# EAGLE design TMotor_Rev0_5 (EAGLE 9.6.2)

## Sheet 1 of 5: Arduino Nano Sense and Teensy
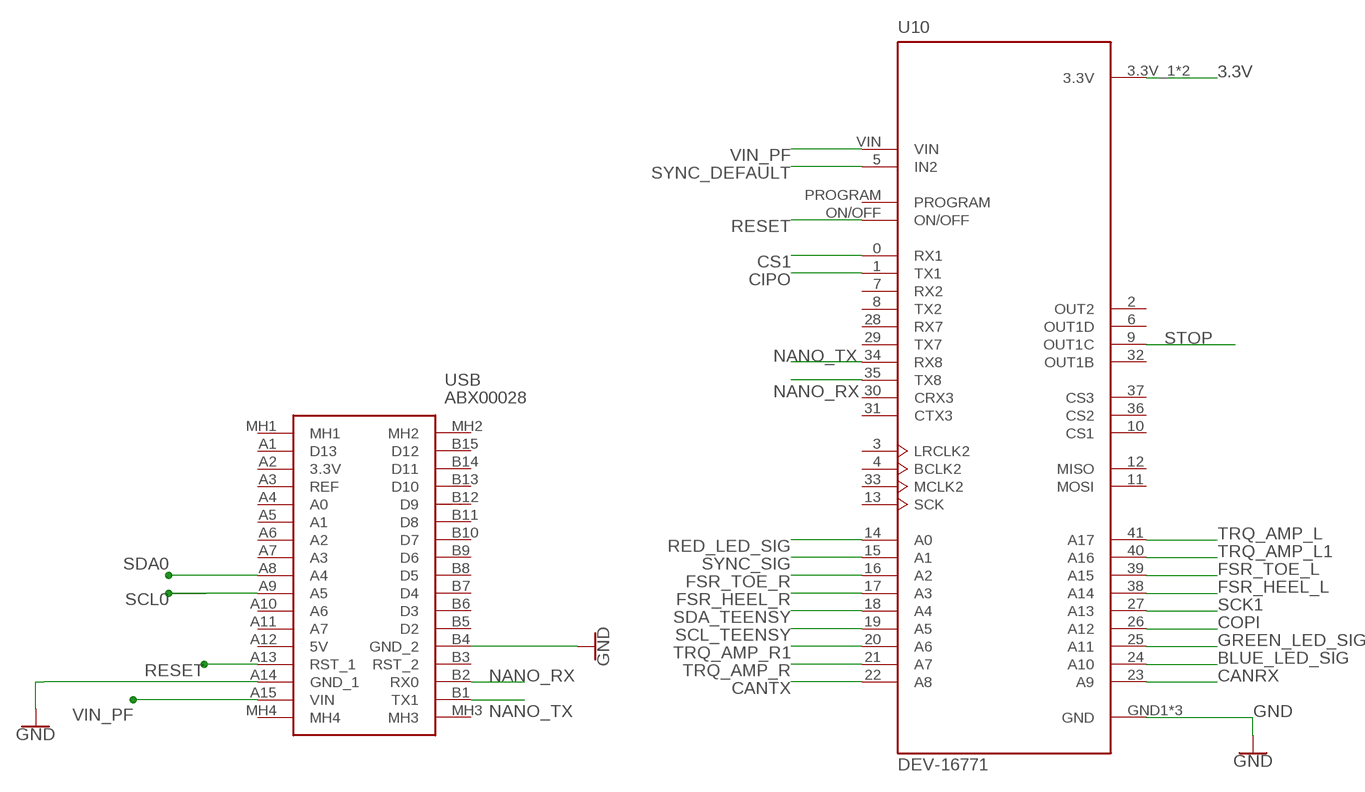
[diagram p0: schematic, sheet 1]

### Parts
U10  DEV-16771  [MODULE_DEV-16771]
USB  ABX00028  [ABX00028]

### Nets
3.3V: U10.3.3V_1(3.3V) U10.3.3V_2(3.3V) ; also sheet 2,3,4,5
BLUE_LED_SIG: U10.24(A10) ; also sheet 4
CANRX: U10.23(A9) ; also sheet 2
CANTX: U10.22(A8) ; also sheet 2
CIPO: U10.1(TX1) ; also sheet 2
COPI: U10.26(A12) ; also sheet 2
CS1: U10.0(RX1) ; also sheet 2
FSR_HEEL_L: U10.38(A14) ; also sheet 3
FSR_HEEL_R: U10.17(A3) ; also sheet 3
FSR_TOE_L: U10.39(A15) ; also sheet 3
FSR_TOE_R: U10.16(A2) ; also sheet 3
GND: U10.GND1(GND) U10.GND2(GND) U10.GND3(GND) USB.A14(GND_1) USB.B4(GND_2) ; also sheet 2,3,4,5
GREEN_LED_SIG: U10.25(A11) ; also sheet 4
NANO_RX: U10.35(TX8) USB.B2(RX0)
NANO_TX: U10.34(RX8) USB.B1(TX1)
RED_LED_SIG: U10.14(A0) ; also sheet 4
RESET: U10.ON/OFF USB.A13(RST_1) ; also sheet 2
SCK1: U10.27(A13) ; also sheet 2
SCL0: USB.A9(A5) ; also sheet 2
SCL_TEENSY: U10.19(A5) ; also sheet 2
SDA0: USB.A8(A4) ; also sheet 2
SDA_TEENSY: U10.18(A4) ; also sheet 2
STOP: U10.9(OUT1C) ; also sheet 2
SYNC_DEFAULT: U10.5(IN2) ; also sheet 2
SYNC_SIG: U10.15(A1) ; also sheet 4
TRQ_AMP_L: U10.41(A17) ; also sheet 5
TRQ_AMP_L1: U10.40(A16) ; also sheet 5
TRQ_AMP_R: U10.21(A7) ; also sheet 5
TRQ_AMP_R1: U10.20(A6) ; also sheet 5
VIN_PF: U10.VIN USB.A15(VIN) ; also sheet 2
Unconnected: U10.2(OUT2) U10.3(LRCLK2) U10.4(BCLK2) U10.6(OUT1D) U10.7(RX2) U10.8(TX2) U10.10(CS1) U10.11(MOSI) U10.12(MISO) U10.13(SCK) U10.28(RX7) U10.29(TX7) U10.30(CRX3) U10.31(CTX3) U10.32(OUT1B) U10.33(MCLK2) U10.36(CS2) U10.37(CS3) U10.PROGRAM USB.A1(D13) USB.A2(3.3V) USB.A3(REF) USB.A4(A0) USB.A5(A1) USB.A6(A2) USB.A7(A3) USB.A10(A6) USB.A11(A7) USB.A12(5V) USB.B3(RST_2) USB.B5(D2) USB.B6(D3) USB.B7(D4) USB.B8(D5) USB.B9(D6) USB.B10(D7) USB.B11(D8) USB.B12(D9) USB.B13(D10) USB.B14(D11) USB.B15(D12) USB.MH1 USB.MH2 USB.MH3 USB.MH4

## Sheet 2 of 5: Motor Drivers & Power
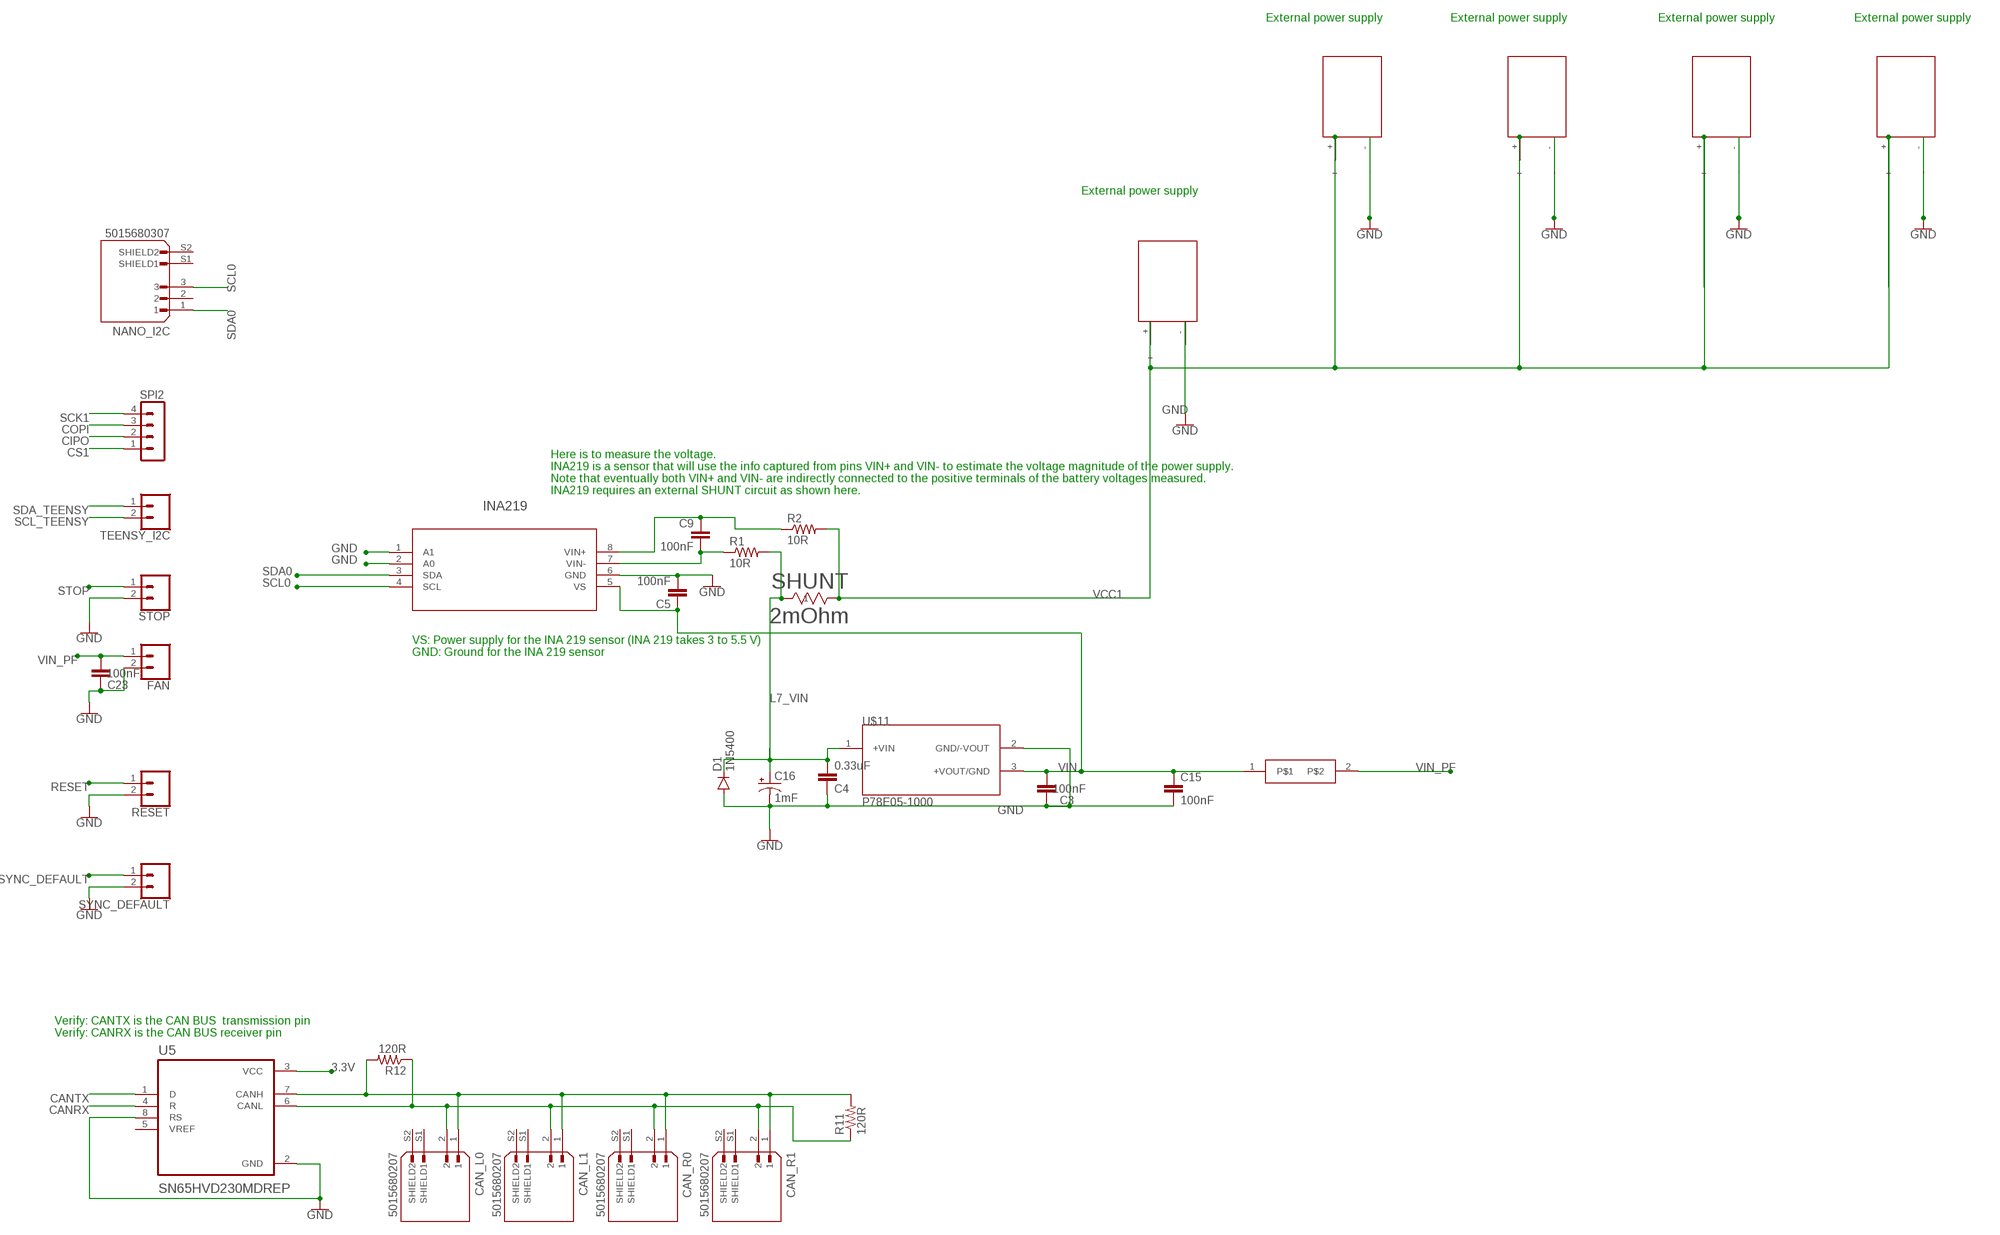
[diagram p1: schematic, sheet 2]

### Parts
C3  100nF  C-EU050-024X044  [C050-024X044]
C4  0.33uF  C-EU050-024X044  [C050-024X044]
C5  100nF  C-EU050-024X044  [C050-024X044]
C9  100nF  C-EU050-024X044  [C050-024X044]
C15  100nF  C-EU050-024X044  [C050-024X044]
C16  1mF  CPOL-USE5-10.5  [E5-10,5]
C23  100nF  C-EU050-024X044  [C050-024X044]
CAN_L0  5015680207  [MOLEX_5015680207]
CAN_L1  5015680207  [MOLEX_5015680207]
CAN_R0  5015680207  [MOLEX_5015680207]
CAN_R1  5015680207  [MOLEX_5015680207]
D1  1N5400  [DO201-15]
FAN  CONN_02  [1X02]
INA219  INA219AIDR  [D8_TEX]
NANO_I2C  5015680307  [MOLEX_5015680307]
R1  10R  R-US_0207/10  [0207/10]
R2  10R  R-US_0207/10  [0207/10]
R11  120R  R-US_0207/10  [0207/10]
R12  120R  R-US_0207/10  [0207/10]
RESET  CONN_02  [1X02]
SHUNT  2mOhm  CSNL2512FT2L00  [STA_CSNL2512(2)_STP]
SPI2  MA04-1  [MA04-1]
STOP  CONN_02  [1X02]
SYNC_DEFAULT  CONN_02  [1X02]
TEENSY_I2C  CONN_02  [1X02]
U5  SN65HVD230MDREP  [SOIC127P599X175-8N]
U$6  0458002.DR  [FUSE_LITTEL_448]
U$11  P78E05-1000  [P78E05-1000]
XT30UPB-F  L_0  XT30UPB-F  [XT30UPB-F]
XT30UPB-F1  L_0  XT30UPB-F  [XT30UPB-F]
XT30UPB-F2  L_0  XT30UPB-F  [XT30UPB-F]
XT30UPB-F3  L_0  XT30UPB-F  [XT30UPB-F]
XT30UPB-F4  L_0  XT30UPB-F  [XT30UPB-F]

### Nets
3.3V: U5.3(VCC) ; also sheet 1,3,4,5
CANRX: U5.4(R) ; also sheet 1
CANTX: U5.1(D) ; also sheet 1
CIPO: SPI2.2 ; also sheet 1
COPI: SPI2.3 ; also sheet 1
CS1: SPI2.1 ; also sheet 1
GND: C3.1 C4.1 C5.2 C15.2 C16.- C23.1 D1.A FAN.2 INA219.1(A1) INA219.2(A0) INA219.6(GND) RESET.2 STOP.2 SYNC_DEFAULT.2 U5.2(GND) U5.8(RS) U$11.2(GND/-VOUT) XT30UPB-F1.- XT30UPB-F2.- XT30UPB-F3.- XT30UPB-F4.- XT30UPB-F.- ; also sheet 1,3,4,5
L7_VIN: C4.2 C16.+ D1.C R1.2 SHUNT.1 U$11.1(+VIN)
N$23: C9.1 INA219.8(VIN+) R2.1
N$26: C9.2 INA219.7(VIN-) R1.1
N$44: CAN_L0.1 CAN_L1.1 CAN_R0.1 CAN_R1.1 R11.2 R12.2 U5.7(CANH)
N$45: CAN_L0.2 CAN_L1.2 CAN_R0.2 CAN_R1.2 R11.1 R12.1 U5.6(CANL)
RESET: RESET.1 ; also sheet 1
SCK1: SPI2.4 ; also sheet 1
SCL0: INA219.4(SCL) NANO_I2C.3 ; also sheet 1
SCL_TEENSY: TEENSY_I2C.2 ; also sheet 1
SDA0: INA219.3(SDA) NANO_I2C.1 ; also sheet 1
SDA_TEENSY: TEENSY_I2C.1 ; also sheet 1
STOP: STOP.1 ; also sheet 1
SYNC_DEFAULT: SYNC_DEFAULT.1 ; also sheet 1
VCC1: R2.2 SHUNT.2 XT30UPB-F1.+ XT30UPB-F2.+ XT30UPB-F3.+ XT30UPB-F4.+ XT30UPB-F.+
VIN: C3.2 C5.1 C15.1 INA219.5(VS) U$6.1 U$11.3(+VOUT/GND)
VIN_PF: C23.2 FAN.1 U$6.2 ; also sheet 1
Unconnected: CAN_L0.S1(SHIELD1) CAN_L0.S2(SHIELD2) CAN_L1.S1(SHIELD1) CAN_L1.S2(SHIELD2) CAN_R0.S1(SHIELD1) CAN_R0.S2(SHIELD2) CAN_R1.S1(SHIELD1) CAN_R1.S2(SHIELD2) NANO_I2C.2 NANO_I2C.S1(SHIELD1) NANO_I2C.S2(SHIELD2) U5.5(VREF)

### Notes on the sheet
- External power supply | External power supply | External power supply | External power supply
- External power supply
- Here is to measure the voltage.
  INA219 is a sensor that will use the info captured from pins VIN+ and VIN- to estimate the voltage magnitude of the power supply.
  Note that eventually both VIN+ and VIN- are indirectly connected to the positive terminals of the battery voltages measured.
  INA219 requires an external SHUNT circuit as shown here.
- VS: Power supply for the INA 219 sensor (INA 219 takes 3 to 5.5 V)
  GND: Ground for the INA 219 sensor
- Verify: CANTX is the CAN BUS  transmission pin
  Verify: CANRX is the CAN BUS receiver pin

## Sheet 3 of 5: FSRs filters
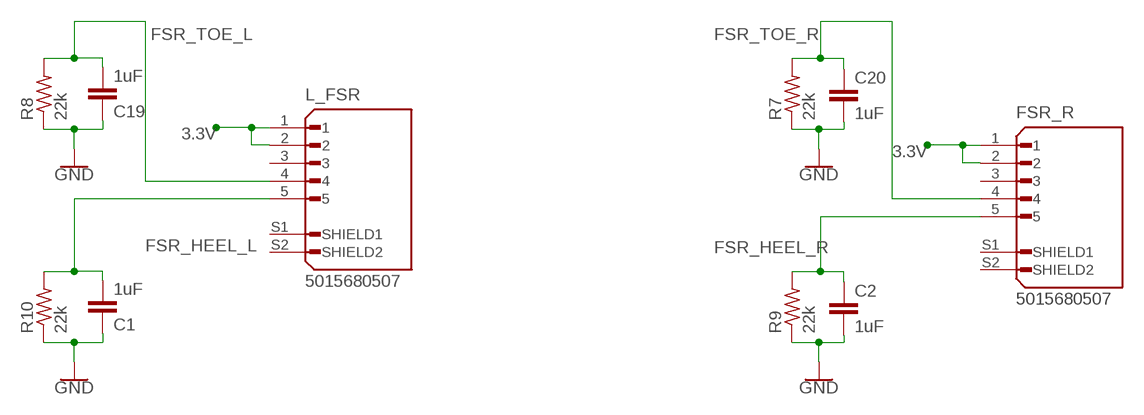
[diagram p2: schematic, sheet 3]

### Parts
C1  1uF  C-EU050-024X044  [C050-024X044]
C2  1uF  C-EU050-024X044  [C050-024X044]
C19  1uF  C-EU050-024X044  [C050-024X044]
C20  1uF  C-EU050-024X044  [C050-024X044]
FSR_R  5015680507  [MOLEX_5015680507]
L_FSR  5015680507  [MOLEX_5015680507]
R7  22k  R-US_0207/10  [0207/10]
R8  22k  R-US_0207/10  [0207/10]
R9  22k  R-US_0207/10  [0207/10]
R10  22k  R-US_0207/10  [0207/10]

### Nets
3.3V: FSR_R.1 FSR_R.2 L_FSR.1 L_FSR.2 ; also sheet 1,2,4,5
FSR_HEEL_L: C1.2 L_FSR.5 R10.2 ; also sheet 1
FSR_HEEL_R: C2.1 FSR_R.5 R9.2 ; also sheet 1
FSR_TOE_L: C19.2 L_FSR.4 R8.2 ; also sheet 1
FSR_TOE_R: C20.1 FSR_R.4 R7.2 ; also sheet 1
GND: C1.1 C2.2 C19.1 C20.2 R7.1 R8.1 R9.1 R10.1 ; also sheet 1,2,4,5
Unconnected: FSR_R.3 FSR_R.S1(SHIELD1) FSR_R.S2(SHIELD2) L_FSR.3 L_FSR.S1(SHIELD1) L_FSR.S2(SHIELD2)

## Sheet 4 of 5: LED
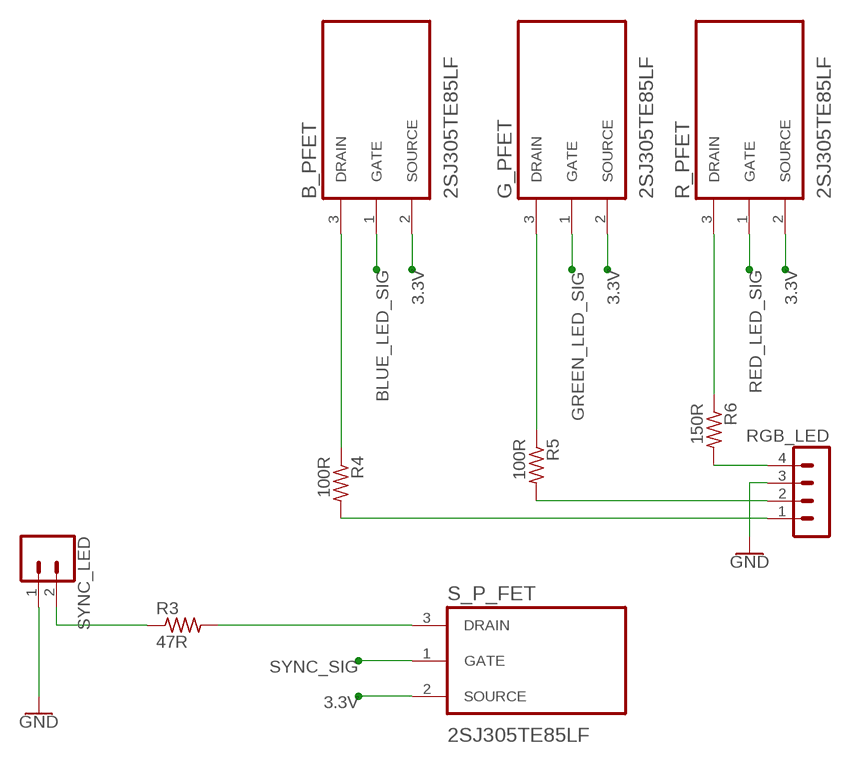
[diagram p3: schematic, sheet 4]

### Parts
B_PFET  2SJ305TE85LF  [TRANS_SSM3J325F,LF]
G_PFET  2SJ305TE85LF  [TRANS_SSM3J325F,LF]
R3  47R  R-US_0207/10  [0207/10]
R4  100R  R-US_0207/10  [0207/10]
R5  100R  R-US_0207/10  [0207/10]
R6  150R  R-US_0207/10  [0207/10]
R_PFET  2SJ305TE85LF  [TRANS_SSM3J325F,LF]
RGB_LED  MA04-1  [MA04-1]
S_P_FET  2SJ305TE85LF  [TRANS_SSM3J325F,LF]
SYNC_LED  CONN_02  [1X02]

### Nets
3.3V: B_PFET.2(SOURCE) G_PFET.2(SOURCE) R_PFET.2(SOURCE) S_P_FET.2(SOURCE) ; also sheet 1,2,3,5
BLUE_LED_SIG: B_PFET.1(GATE) ; also sheet 1
GND: RGB_LED.3 SYNC_LED.1 ; also sheet 1,2,3,5
GREEN_LED_SIG: G_PFET.1(GATE) ; also sheet 1
N$1: R4.2 RGB_LED.1
N$2: B_PFET.3(DRAIN) R4.1
N$17: R3.2 S_P_FET.3(DRAIN)
N$18: R3.1 SYNC_LED.2
N$24: R6.2 RGB_LED.4
N$25: R5.2 RGB_LED.2
N$30: G_PFET.3(DRAIN) R5.1
N$31: R6.1 R_PFET.3(DRAIN)
RED_LED_SIG: R_PFET.1(GATE) ; also sheet 1
SYNC_SIG: S_P_FET.1(GATE) ; also sheet 1

## Sheet 5 of 5: Bluetooth
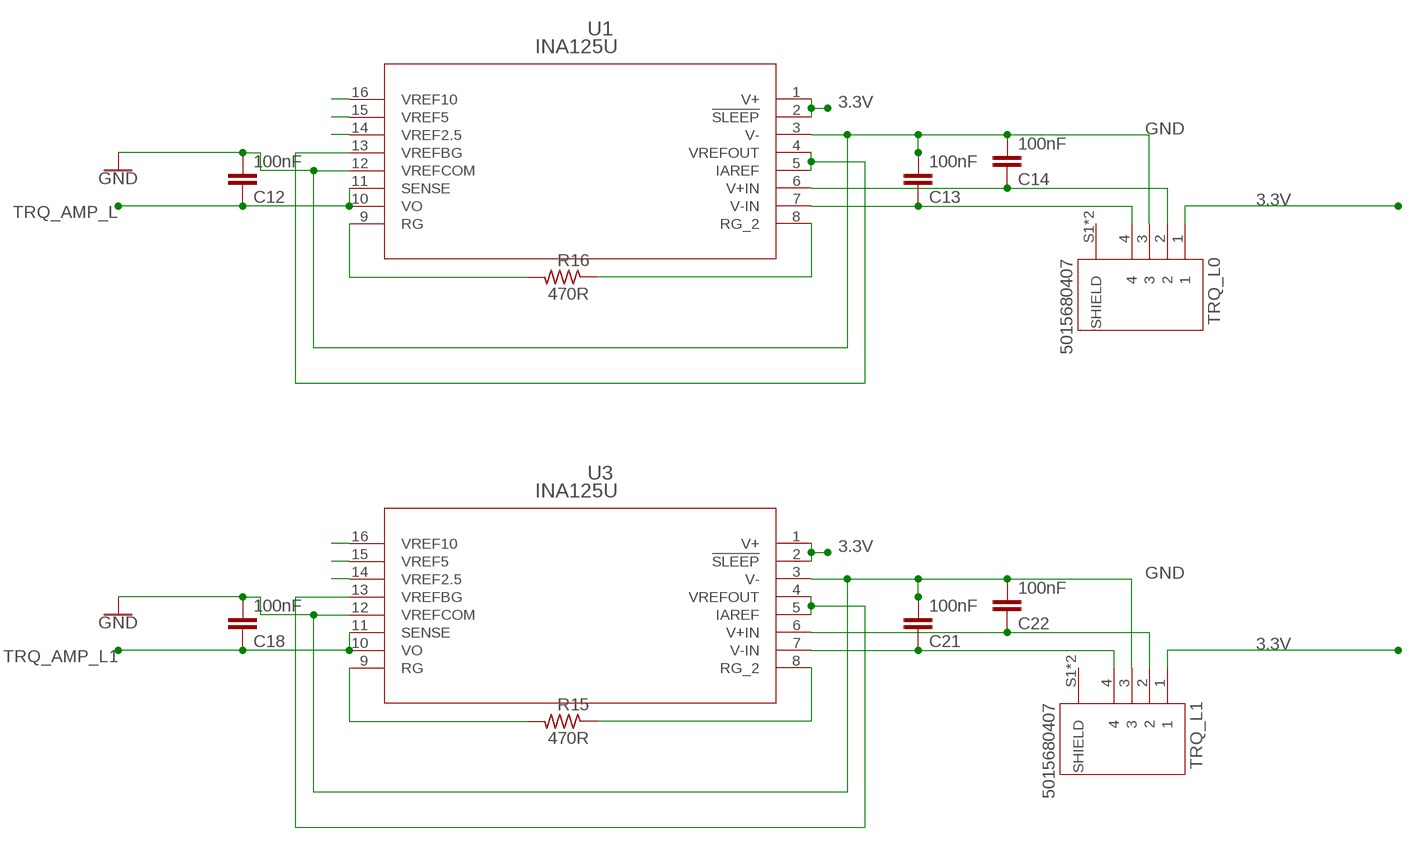
[diagram p4: schematic, sheet 5, part 1 of 2]
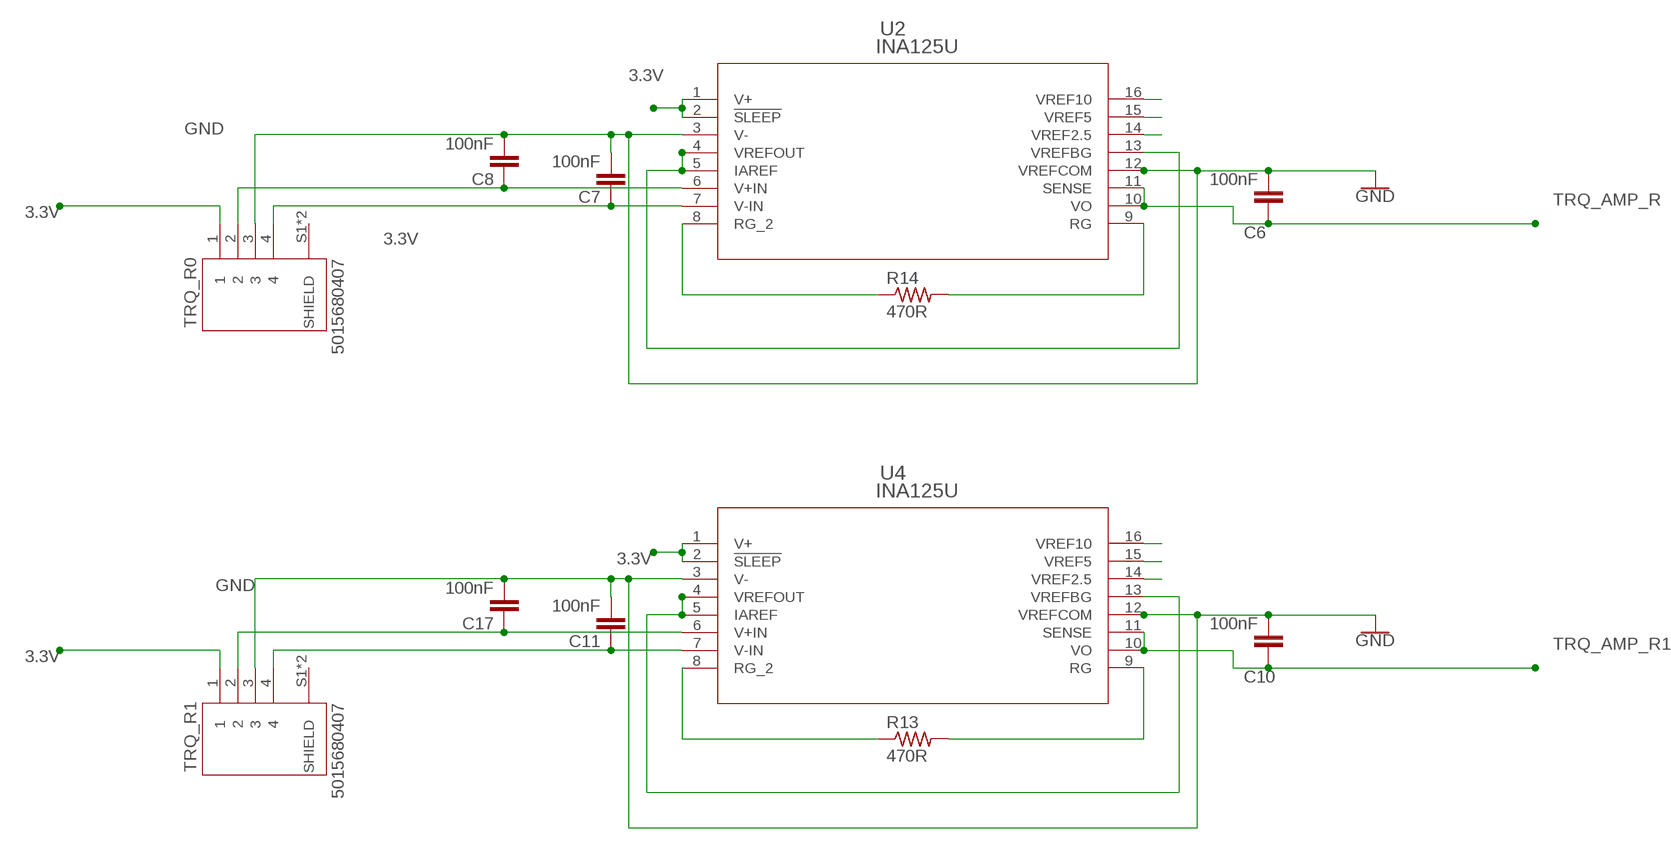
[diagram p5: schematic, sheet 5, part 2 of 2]

### Parts
C6  100nF  C-EU050-024X044  [C050-024X044]
C7  100nF  C-EU050-024X044  [C050-024X044]
C8  100nF  C-EU050-024X044  [C050-024X044]
C10  100nF  C-EU050-024X044  [C050-024X044]
C11  100nF  C-EU050-024X044  [C050-024X044]
C12  100nF  C-EU050-024X044  [C050-024X044]
C13  100nF  C-EU050-024X044  [C050-024X044]
C14  100nF  C-EU050-024X044  [C050-024X044]
C17  100nF  C-EU050-024X044  [C050-024X044]
C18  100nF  C-EU050-024X044  [C050-024X044]
C21  100nF  C-EU050-024X044  [C050-024X044]
C22  100nF  C-EU050-024X044  [C050-024X044]
R13  470R  R-US_0207/10  [0207/10]
R14  470R  R-US_0207/10  [0207/10]
R15  470R  R-US_0207/10  [0207/10]
R16  470R  R-US_0207/10  [0207/10]
TRQ_L0  5015680407  [MOLEX_5015680407]
TRQ_L1  5015680407  [MOLEX_5015680407]
TRQ_R0  5015680407  [MOLEX_5015680407]
TRQ_R1  5015680407  [MOLEX_5015680407]
U1  INA125U  [D16]
U2  INA125U  [D16]
U3  INA125U  [D16]
U4  INA125U  [D16]

### Nets
3.3V: TRQ_L0.1 TRQ_L1.1 TRQ_R0.1 TRQ_R1.1 U1.1(V+) U1.2(!SLEEP) U2.1(V+) U2.2(!SLEEP) U3.1(V+) U3.2(!SLEEP) U4.1(V+) U4.2(!SLEEP) ; also sheet 1,2,3,4
GND: C6.2 C7.2 C8.2 C10.2 C11.2 C12.2 C13.2 C14.2 C17.2 C18.2 C21.2 C22.2 TRQ_L0.3 TRQ_L1.3 TRQ_R0.3 TRQ_R1.3 U1.3(V-) U1.12(VREFCOM) U2.3(V-) U2.12(VREFCOM) U3.3(V-) U3.12(VREFCOM) U4.3(V-) U4.12(VREFCOM) ; also sheet 1,2,3,4
N$3: U1.4(VREFOUT) U1.5(IAREF) U1.13(VREFBG)
N$4: U4.16(VREF10)
N$5: U2.4(VREFOUT) U2.5(IAREF) U2.13(VREFBG)
N$6: R14.1 U2.8(RG_2)
N$7: R14.2 U2.9(RG)
N$8: C8.1 TRQ_R0.2 U2.6(V+IN)
N$9: C7.1 TRQ_R0.4 U2.7(V-IN)
N$10: C14.1 TRQ_L0.2 U1.6(V+IN)
N$11: C13.1 TRQ_L0.4 U1.7(V-IN)
N$12: R16.2 U1.9(RG)
N$13: R16.1 U1.8(RG_2)
N$14: U4.15(VREF5)
N$15: U4.4(VREFOUT) U4.5(IAREF) U4.13(VREFBG)
N$16: R13.1 U4.8(RG_2)
N$19: U4.14(VREF2.5)
N$20: U2.16(VREF10)
N$21: U2.15(VREF5)
N$22: U2.14(VREF2.5)
N$27: R13.2 U4.9(RG)
N$28: C17.1 TRQ_R1.2 U4.6(V+IN)
N$29: C11.1 TRQ_R1.4 U4.7(V-IN)
N$32: U3.4(VREFOUT) U3.5(IAREF) U3.13(VREFBG)
N$33: C22.1 TRQ_L1.2 U3.6(V+IN)
N$34: C21.1 TRQ_L1.4 U3.7(V-IN)
N$35: R15.2 U3.9(RG)
N$36: R15.1 U3.8(RG_2)
N$37: U1.16(VREF10)
N$38: U1.15(VREF5)
N$39: U1.14(VREF2.5)
N$40: U3.16(VREF10)
N$41: U3.15(VREF5)
N$42: U3.14(VREF2.5)
TRQ_AMP_L: C12.1 U1.10(VO) U1.11(SENSE) ; also sheet 1
TRQ_AMP_L1: C18.1 U3.10(VO) U3.11(SENSE) ; also sheet 1
TRQ_AMP_R: C6.1 U2.10(VO) U2.11(SENSE) ; also sheet 1
TRQ_AMP_R1: C10.1 U4.10(VO) U4.11(SENSE) ; also sheet 1
Unconnected: TRQ_L0.S1(SHIELD) TRQ_L0.S2(SHIELD) TRQ_L1.S1(SHIELD) TRQ_L1.S2(SHIELD) TRQ_R0.S1(SHIELD) TRQ_R0.S2(SHIELD) TRQ_R1.S1(SHIELD) TRQ_R1.S2(SHIELD)

## Library data of the parts
B_PFET G_PFET R_PFET S_P_FET = 2SJ305TE85LF:2SJ305TE85LF: None Check prices <https://pricing.snapeda.com/parts/2SJ305TE85LF/Toshiba/view-part?ref=eda>; AVAILABILITY: In Stock; DESCRIPTION: P-Channel 30V 200mA (Ta) 200mW (Ta) Surface Mount SC-59; MF: Toshiba; MP: 2SJ305TE85LF; PACKAGE: SC-59 Toshiba; PRICE: None; PURCHASE-URL: https://pricing.snapeda.com/search/part/2SJ305TE85LF/?ref=eda
C1-C15 C17-C23 = rcl:C-EU: CAPACITOR, European symbol; SPICEPREFIX: C
C16 = rcl:CPOL-US: POLARIZED CAPACITOR, American symbol; SPICEPREFIX: C
CAN_L0 CAN_L1 CAN_R0 CAN_R1 = SnapEDA-Library:5015680207; MANUFACTURER: Molex; MAXIMUM_PACKAGE_HEIGHT: 3.2 mm; PARTREV: A; STANDARD: Manufacturer Recommendations
D1 = diode:1N5400: DIODE standard rectifier, 3 A, 50 V (Motorola)
FAN RESET STOP SYNC_DEFAULT SYNC_LED TEENSY_I2C = SparkFun-Connectors:CONN_02: Multi connection point. Often used as Generic Header-pin footprint for 0.1 inch spaced/style header connections On any of the 0.1 inch spaced packages, you can populate with these: Break Away Headers - Straight <https://www.sparkfun.com/products/116> (PRT-00116) Break Away Male Headers - Right Angle <https://www.sparkfun.com/products/553> (PRT-00553) Female Headers <https://www.sparkfun.com/products/115> (PRT-00115) Break Away Headers - Machine Pin <https://www.sparkfun.com/products/117> (PRT-00117) Break Away Female Headers - Swiss Machine Pin <https://www.sparkfun.com/products/743> (PRT-00743) For SCREWTERMINALS and SPRING TERMINALS visit here: Screw Terimnals on SparkFun.com <https://www.sparkfun.com/search/results?term=Screw+Terminals> (5mm/3.5mm/2.54mm spacing) This device is also useful as a general connection point to wire up your design to another part of your project. Our various solder wires solder well into these plated through hole pads. Hook-Up Wire - Assortment (Stranded, 22 AWG) <https://www.sparkfun.com/products/11375> (PRT-11375) Hook-Up Wire - Assortment (Solid Core, 22 AWG) <https://www.sparkfun.com/products/11367> (PRT-11367) View the entire wire category on our website here <https://www.sparkfun.com/categories/141> Special notes: Molex polarized connector foot print use with: PRT-08233 with associated crimp pins and housings. 2.54_SCREWTERM for use with PRT-10571. 3.5mm Screw Terminal footprints for PRT-08084 5mm Screw Terminal footprints for use with PRT-08432
FSR_R L_FSR = SnapEDA-Library:5015680507; MANUFACTURER: Molex; MAXIMUM_PACKAGE_HEIGHT: 3.2 mm; PARTREV: A; STANDARD: Manufacturer Recommendations
INA219 = INA219:INA219AIDR; BUILT_BY: EMA_UL_Team; MANUFACTURER_PART_NUMBER: INA219AIDR; SOURCELIBRARY: TI_2015-1-5; VENDOR: Texas Instruments
NANO_I2C = SnapEDA-Library:5015680307; MANUFACTURER: Molex; MAXIMUM_PACKAGE_HEIGHT: 3.2 mm; PARTREV: A; STANDARD: Manufacturer Recommendations
R1-R6 R11-R16 = rcl:R-US_: RESISTOR, American symbol; SPICEPREFIX: R
R7-R10 = resistor:R-US_: RESISTOR, American symbol
RGB_LED SPI2 = con-lstb:MA04-1: PIN HEADER; OC_FARNELL: unknown; OC_NEWARK: unknown
SHUNT = ShuntResistor:CSNL2512FT2L00; BUILT_BY: EMA_UL_Team; MANUFACTURER_PART_NUMBER: CSNL2512FT2L00; SOURCELIBRARY: Stackpole_2014-12-31; VENDOR: Stackpole International
TRQ_L0 TRQ_L1 TRQ_R0 TRQ_R1 = SnapEDA-Library:5015680407: Conn Shrouded Header HDR 4 POS 1mm Solder RA SMD Pico-Clasp????? Embossed T/R; MANUFACTURER: MOLEX; PARTREV: C; STANDARD: Manufacturer Recommendation
U1-U4 = Digikey:INA125U; DATASHEET_URL: http://www.ti.com/lit/gpn/INA125; DESCRIPTION: Instrumentation Amplifier with Precision Voltage Reference; FAMILY_NAME: SINGLE SUPPLY; GENERIC_PART_NUMBER: INA125; INDUSTRY_STD_PKG_TYPE: SOIC; MANUFACTURER: Texas Instruments; MANUFACTURER_PART_NUMBER: INA125U; PACKAGE_DESIGNATOR: D; PIN_COUNT: 16; VENDOR: Texas Instruments
U5 = SnapEDA-Library:SN65HVD230MDREP
U10 = SnapEDA-Library:DEV-16771: RT1062 Teensy 4.1 i.MX ARM Cortex-M7 MPU Embedded Evaluation Board; MANUFACTURER: SparkFun Electronics; MAXIMUM_PACKAGE_HEIGHT: 4.07mm; PARTREV: 4.1; STANDARD: Manufacturer recommendations
U$6 = SnapEDA-Library (1):0458002.DR: 0448002.MR Digi-Key Part Number - F1638TR-ND - Tape & Reel (TR) - F1638CT-ND - Cut Tape (CT) - F1638DKR-ND - Digi-Reel® Manufacturer - Littelfuse Inc. Manufacturer Product Number - 0448002.MR Description - FUSE BOARD MNT 2A 125VAC/VDC SMD
U$11 = SnapEDA-Library_Paul:P78E05-1000: Digikey 102-5018-ND Non-Isolated PoL Module DC DC Converter 1 Output 5V 1A 8V - 36V Input
USB = ABX00028:ABX00028: Development Boards & Kits - AVR Arduino Nano Every Source: Datasheet <https://store.arduino.cc/arduino-nano-every>; ARROW_PART_NUMBER: ABX00028; ARROW_PRICE-STOCK: https://www.arrow.com/en/products/abx00028/arduino-corporation; DESCRIPTION: Development Boards & Kits - AVR Arduino Nano Every; HEIGHT: 10mm; MANUFACTURER_NAME: Arduino; MANUFACTURER_PART_NUMBER: ABX00028; MOUSER_PART_NUMBER: 782-ABX00028; MOUSER_PRICE-STOCK: https://www.mouser.co.uk/ProductDetail/Arduino/ABX00028/?qs=PzGy0jfpSMtit6rnFl8mVg%3D%3D
XT30UPB-F XT30UPB-F1-XT30UPB-F4 = XT30UPB-F:XT30UPB-F: XT30 PCB Mount Upright Female Power Connector. 15A cont. 30A burst.

## Board
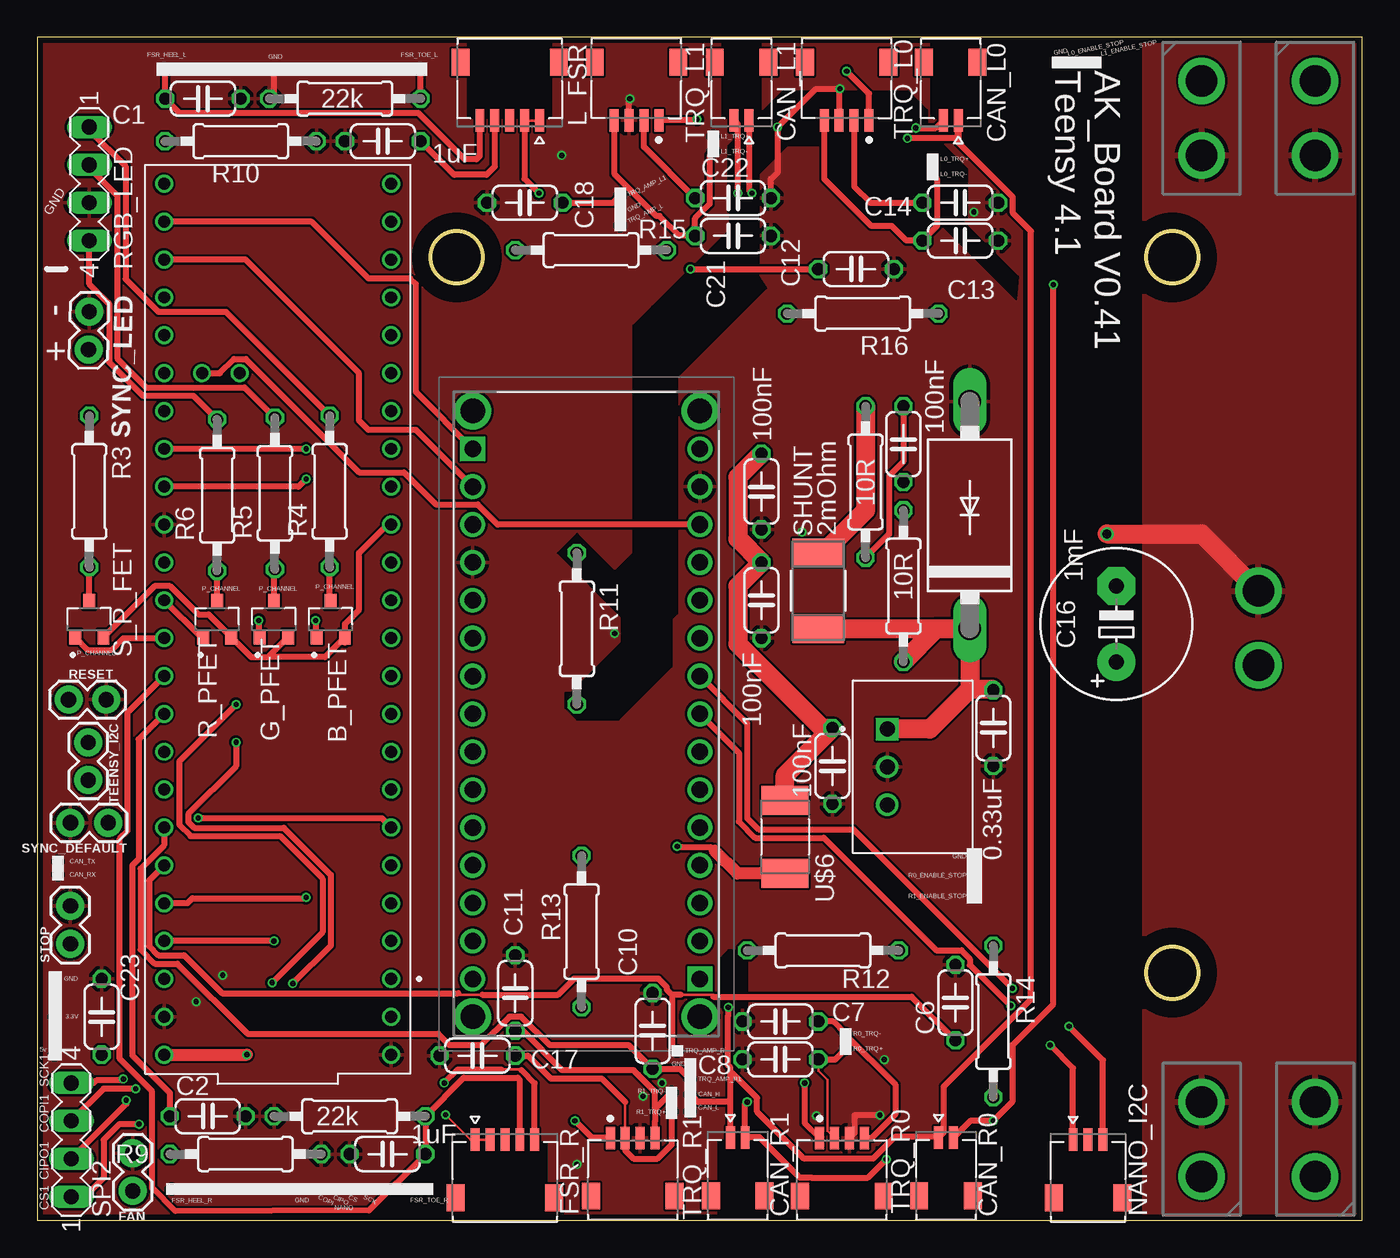
[diagram p6: board, top side]
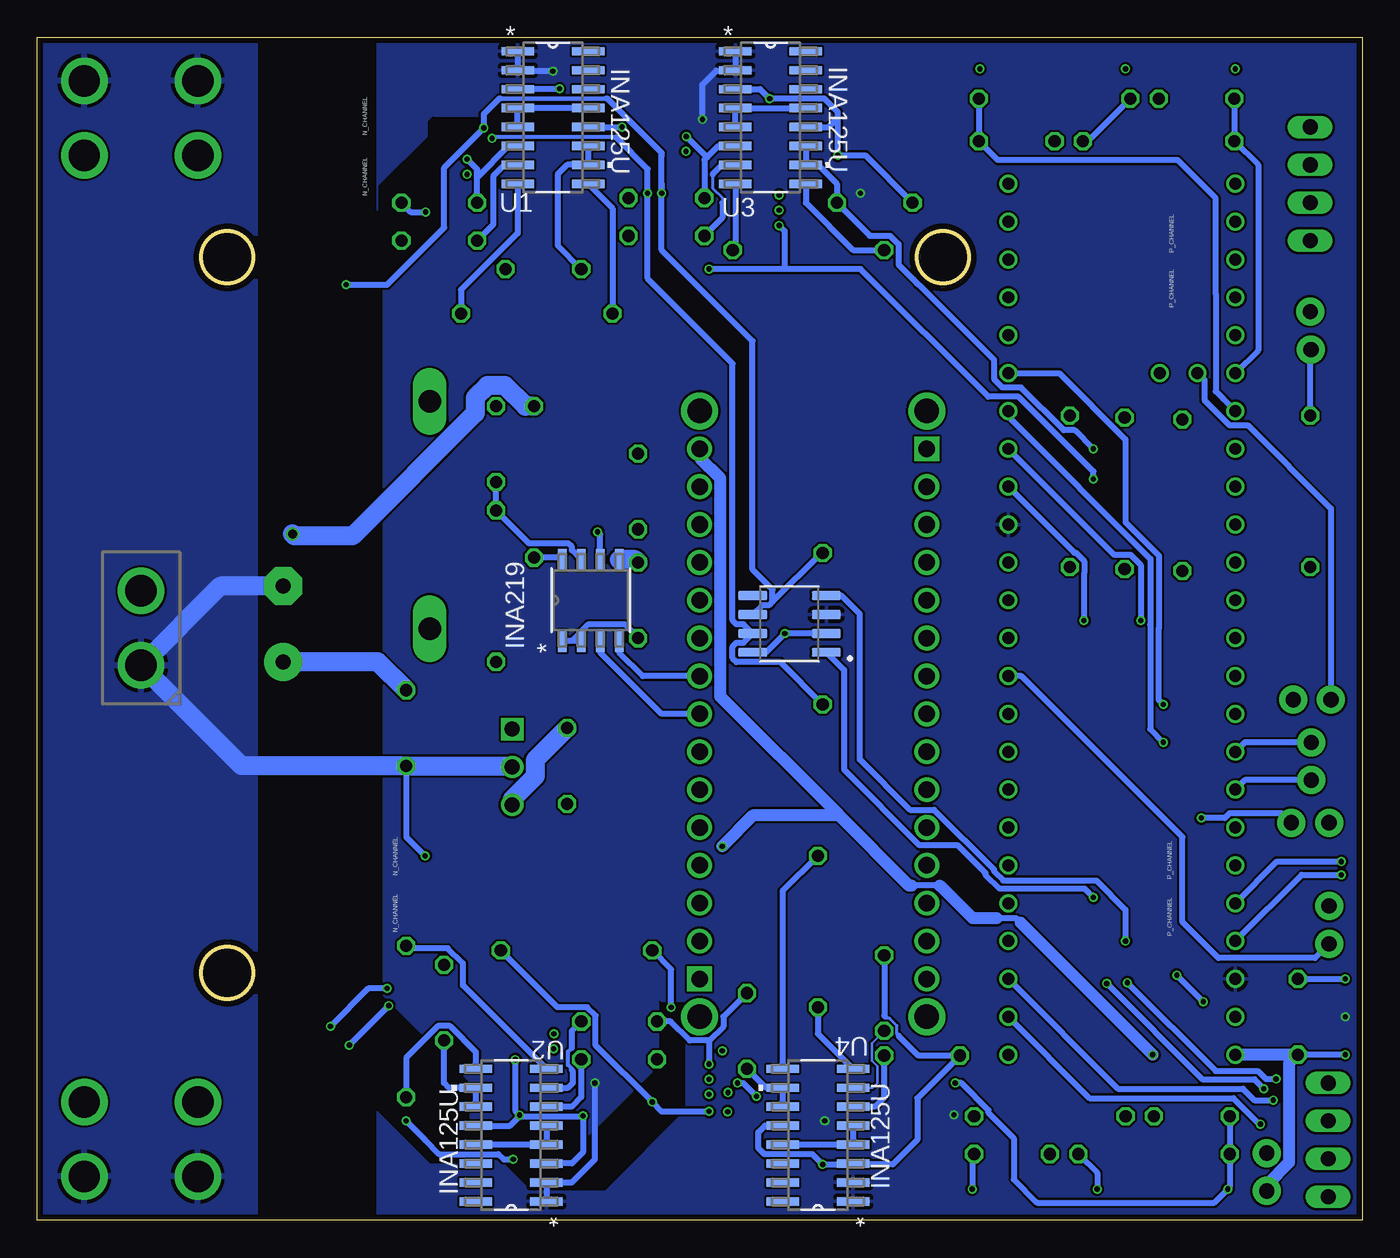
[diagram p7: board, bottom side, seen from below]

Size 88.88 x 79.36 mm. Coordinates in mm from the lower left corner, seen from the top.
Outline: 0,0 88.88,0 88.88,79.36 0,79.36 0,0
Outline: circle at 28.13,64.6 radius 1.75
Outline: circle at 76.13,64.6 radius 1.75
Outline: circle at 76.13,16.6 radius 1.75
Copper layers (1*16): Top 0.035559375mm / dielectric 1.6mm / Bottom 0.035559375mm
Design rules "oshpark-2layer": minimum track width 6mil, minimum drill 10mil, track to track 6mil, track to pad 6mil, pad to pad 6mil, via to via 6mil, smd to smd 6mil, copper to edge 15mil, drill to drill 6mil, minimum pad ring 5mil, minimum via ring 5mil, stop-mask expansion 2.5mil, vias tented up to drill 0mil, thermal gap 10mil
tRestrict: area 36.2,37.1 to 48.9,66.4; area 56.8,18.1 to 58.2,18.1; area 45.7,14.3 to 47.6,18.1; area 34.9,33.6 to 42.5,46; area 58.7,68.9 to 59.1,69.3; area 46.4,63.6 to 48.4,67.6; area 73.1,61.6 to 79.1,67.6; area 73.1,13.6 to 79.1,19.6; area 25.1,61.6 to 31.1,67.6; area 46.4,61.8 to 65.8,75.8; area 56.3,3.1 to 64.9,7.2
bRestrict: area 45.6,8.1 to 47,14.3; area 57.7,3.9 to 68.6,74; area 45.5,2.1 to 60.5,14.7

### Footprints (pad centres in the part's own frame; a part is rotated, then mirrored left to right if it is on the bottom)
TRANS_SSM3J325F,LF = smd 1 x 0.8: 1 -1.2,0.95; 2 -1.2,-0.95; 3 1.2,0
C050-024X044 = drill 0.813 octagon: 1 -2.54,0; 2 2.54,0
E5-10,5 = drill 1.016 pad 2.54: + -2.54,0 | drill 1.016 pad 2.54 octagon: - 2.54,0
MOLEX_5015680207 = smd 0.6 x 1.5: 1 -0.5,2.55; 2 0.5,2.55 | smd 1.2 x 1.8: S1 1.8,-1.35; S2 -1.8,-1.35
DO201-15 = drill 1.499 long: A 7.62,0; C -7.62,0
1X02 = drill 1.016 pad 1.88: 1 0,0; 2 2.54,0
MOLEX_5015680507 = smd 0.6 x 1.5: 1 -2,2.55; 2 -1,2.55; 3 0,2.55; 4 1,2.55; 5 2,2.55 | smd 1.2 x 1.8: S1 3.3,-1.35; S2 -3.3,-1.35
D8_TEX = smd 1.46 x 0.559: 1 -2.724,1.905; 2 -2.724,0.635; 3 -2.724,-0.635; 4 -2.724,-1.905; 5 2.724,-1.905; 6 2.724,-0.635; 7 2.724,0.635; 8 2.724,1.905
MOLEX_5015680307 = smd 0.6 x 1.5: 1 -1,2.55; 2 0,2.55; 3 1,2.55 | smd 1.2 x 1.8: S1 2.3,-1.35; S2 -2.3,-1.35
0207/10 = drill 0.813 octagon: 1 -5.08,0; 2 5.08,0
MA04-1 = drill 1.016 long: 1 -3.81,0; 2 -1.27,0; 3 1.27,0; 4 3.81,0
STA_CSNL2512(2)_STP = smd 1.88 x 3.429: 1 -2.565,0; 2 2.565,0
MOLEX_5015680407 = smd 0.6 x 1.5: 1 -1.5,0; 2 -0.5,0; 3 0.5,0; 4 1.5,0 | smd 1.2 x 1.8: S1 -2.8,-3.9; S2 2.8,-3.9
D16 = smd 2.184 x 0.559: 1 -2.362,4.445; 2 -2.362,3.175; 3 -2.362,1.905; 4 -2.362,0.635; 5 -2.362,-0.635; 6 -2.362,-1.905; 7 -2.362,-3.175; 8 -2.362,-4.445; 9 2.362,-4.445; 10 2.362,-3.175; 11 2.362,-1.905; 12 2.362,-0.635; 13 2.362,0.635; 14 2.362,1.905; 15 2.362,3.175; 16 2.362,4.445
SOIC127P599X175-8N = smd 1.97 x 0.6: 1 -2.47,1.905; 2 -2.47,0.635; 3 -2.47,-0.635; 4 -2.47,-1.905; 5 2.47,-1.905; 6 2.47,-0.635; 7 2.47,0.635; 8 2.47,1.905
MODULE_DEV-16771 = drill 0.8: 0 -26.67,-7.62; 1 -24.13,-7.62; 2 -21.59,-7.62; 3 -19.05,-7.62; 3.3V_1 6.35,-7.62; 3.3V_2 -24.13,7.62; 4 -16.51,-7.62; 5 -13.97,-7.62; 6 -11.43,-7.62; 7 -8.89,-7.62; 8 -6.35,-7.62; 9 -3.81,-7.62; 10 -1.27,-7.62; 11 1.27,-7.62; 12 3.81,-7.62; 13 3.81,7.62; 14 1.27,7.62; 15 -1.27,7.62; 16 -3.81,7.62; 17 -6.35,7.62; 18 -8.89,7.62; 19 -11.43,7.62; 20 -13.97,7.62; 21 -16.51,7.62; 22 -19.05,7.62; 23 -21.59,7.62; 24 8.89,-7.62; 25 11.43,-7.62; 26 13.97,-7.62; 27 16.51,-7.62; 28 19.05,-7.62; 29 21.59,-7.62; 30 24.13,-7.62; 31 26.67,-7.62; 32 29.21,-7.62; 33 29.21,7.62; 34 26.67,7.62; 35 24.13,7.62; 36 21.59,7.62; 37 19.05,7.62; 38 16.51,7.62; 39 13.97,7.62; 40 11.43,7.62; 41 8.89,7.62; GND1 -29.21,-7.62; GND2 6.35,7.62; GND3 -26.67,7.62; ON/OFF 16.51,5.08; PROGRAM 16.51,2.54; VIN -29.21,7.62
FUSE_LITTEL_448 = smd 1.956 x 3.15: 1 -2.451,0; 2 2.451,0
P78E05-1000 = drill 1 square: 1 -2.54,-2.54 | drill 1: 2 0,-2.54; 3 2.54,-2.54
ABX00028 = drill 1.11 pad 1.665 square: A1 0,0; B1 35.56,15.24 | drill 1.11 pad 1.665: A2 2.54,0; A3 5.08,0; A4 7.62,0; A5 10.16,0; A6 12.7,0; A7 15.24,0; A8 17.78,0; A9 20.32,0; A10 22.86,0; A11 25.4,0; A12 27.94,0; A13 30.48,0; A14 33.02,0; A15 35.56,0; B2 33.02,15.24; B3 30.48,15.24; B4 27.94,15.24; B5 25.4,15.24; B6 22.86,15.24; B7 20.32,15.24; B8 17.78,15.24; B9 15.24,15.24; B10 12.7,15.24; B11 10.16,15.24; B12 7.62,15.24; B13 5.08,15.24; B14 2.54,15.24; B15 0,15.24 | drill 1.65 pad 2.475: MH1 -2.54,0; MH2 -2.54,15.24; MH3 38.1,15.24; MH4 38.1,0
XT30UPB-F = drill 2.1: + 0,0; - 5,0

### Placement (x,y rotation side)
B_PFET  19.69,40.33 90 top
C1  11.11,75.25 180 top
C2  11.43,6.99 0 top
C3  48.58,41.59 90 top
C4  64.14,33.02 90 top
C5  53.34,30.48 270 top
C6  61.59,14.61 90 top
C7  49.85,13.34 180 top
C8  49.85,10.8 180 top
C9  58.1,52.07 270 top
C10  41.27,12.7 90 top
C11  32.07,15.24 90 top
C12  54.93,63.82 0 top
C13  61.91,65.72 0 top
C14  61.91,68.27 0 top
C15  48.58,48.9 270 top
C16  72.39,40.01 90 top
C17  29.53,11.05 180 top
C18  32.7,68.27 180 top
C19  23.18,72.39 0 top
C20  23.5,4.45 180 top
C21  46.67,66.04 0 top
C22  46.67,68.58 0 top
C23  4.32,13.65 270 top
CAN_L0  61.28,76.33 180 top
CAN_L1  47.24,76.33 180 top
CAN_R0  60.96,2.99 0 top
CAN_R1  46.99,2.99 0 top
D1  62.55,47.31 90 top
FAN  6.41,1.97 90 top
FSR_R  31.37,2.87 0 top
G_PFET  15.88,40.33 90 top
INA219  51.75,41.59 90 bottom
L_FSR  31.69,76.33 180 top
NANO_I2C  70.48,2.86 0 top
R1  58.1,42.55 270 top
R2  55.56,49.53 90 top
R3  3.49,48.9 270 top
R4  19.62,48.9 90 top
R5  15.94,48.77 90 top
R6  12.07,48.64 90 top
R7  20.96,6.99 0 top
R8  20.64,75.25 0 top
R9  13.97,4.45 180 top
R10  13.65,72.39 180 top
R11  36.2,39.69 270 top
R12  52.7,18.1 180 top
R13  36.51,19.37 90 top
R14  64.14,13.34 270 top
R15  37.15,65.09 180 top
R16  55.37,60.84 180 top
R_PFET  12.07,40.33 90 top
RESET  2.1,34.93 0 top
RGB_LED  3.49,69.53 270 top
S_P_FET  3.49,40.33 90 top
SHUNT  52.39,42.23 90 top
SPI2  2.29,5.4 90 top
STOP  2.22,18.54 90 top
SYNC_DEFAULT  4.76,26.67 180 top
SYNC_LED  3.49,60.96 268.8 top
TEENSY_I2C  3.43,32.07 270 top
TRQ_L0  54.29,73.79 180 top
TRQ_L1  40.2,73.79 180 top
TRQ_R0  53.98,5.53 0 top
TRQ_R1  39.94,5.53 0 top
U1  54.29,73.98 0 bottom
U2  57.09,5.72 180 bottom
U3  39.69,73.98 0 bottom
U4  36.51,5.72 180 bottom
U5  38.42,40.01 180 bottom
U10  16.13,40.33 90 top
U$6  50.17,25.72 270 top
U$11  59.56,30.42 270 top
USB  44.45,16.2 90 top
XT30UPB-F  78.11,71.44 90 top
XT30UPB-F1  85.72,71.44 90 top
XT30UPB-F2  78.11,7.94 270 top
XT30UPB-F3  85.72,7.94 270 top
XT30UPB-F4  81.91,42.23 270 bottom

### Tracks (layer width: path | path; a pad name or v marks a point on that pad's centre or on a via)
3.3V  (via drill 0.35)
  Top 0.152: FSR_R.2 FSR_R.1 29.07,5.42 v27.39,7.09 | L_FSR.2 L_FSR.1
  Top 0.406: TRQ_L0.1 55.79,75.59 v54.29,77.09 | v44.26,73.85 44.2,73.79 TRQ_L1.1 | v33.66,68.9 32.69,69.87 L_FSR.2 | TRQ_R1.1 37.2,5.53 v36.06,6.67 | 20.64,38.73 B_PFET.2 | B_PFET.2 20.64,40.01 21.59,40.96 21.59,44.77 23.5,46.68 U10.3.3V_1 | S_P_FET.2 7.87,42.55 8.91,42.55 10.81,40.64 11.5,40.64 R_PFET.2 14.36,37.79 15.48,37.79 | 15.48,37.79 G_PFET.2 | B_PFET.2 19.3,37.79 15.48,37.79 | v51.48,9.21 51.48,6.52 TRQ_R0.1
  Bottom 0.406: U3.1 U3.2 42.08,77.12 43.32,77.12 44.26,76.18 v44.26,73.85 | U1.1 U1.2 56.59,77.09 v54.29,77.09 | v51.48,9.21 51.48,4.09 53.02,2.54 U2.2 U2.1
  other vias: 1.14,13.65
  pour Bottom: -1.27,80.65 66.04,80.65 66.04,-1.65 -1.27,-1.65
BLUE_LED_SIG  (via drill 0.35)
  Top 0.406: v18.67,40.24 18.67,39.19 B_PFET.1
  Bottom 0.406: U10.24 19.32,44.78 19.22,44.78 18.66,44.22 18.66,43.42 18.67,43.41 v18.67,40.24
CANRX  (via drill 0.35)
  Top 0.406: v15.88,18.73 U10.23
  Bottom 0.406: U5.4 34.93,41.91 33.7,40.69 33.7,30.91 30.33,27.54 28.72,27.54 24.71,23.53 24.71,23.42 24.08,22.8 17.83,22.8 15.88,20.84 v15.88,18.73 | U10.23 4.06,23.18 v1.4,23.18
CANTX  (via drill 0.35)
  Top 0.406: U10.22 10.07,21.27 10.39,21.6 17.98,21.6 v18.03,21.66
  Bottom 0.406: U5.1 34.77,36.92 34.77,30.23 29.7,25.17 27.13,25.17 25.26,23.3 25.26,23.19 24.32,22.24 18.62,22.24 v18.03,21.66 | U10.22 5.71,24.07 v1.4,24.07
CIPO  (via drill 0.35)
  Top 0.406: v5.97,8.07 5.97,7.81 SPI2.2
  Bottom 0.406: U10.1 16.38,8.83 8,8.83 7.24,8.07 v5.97,8.07
COPI  (via drill 0.35)
  Top 0.406: v13.34,32.07 13.34,30.46 10.14,27.26 10.14,26.72 10.52,26.33 16.53,26.33 19.69,23.18 19.69,18.42 v17.14,15.88 | v6.6,8.83 4.44,8.83 SPI2.3
  Bottom 0.406: U10.26 23.75,53.91 14.2,44.37 14.2,39.97 14.22,39.94 14.22,32.96 v13.34,32.07 | v17.14,15.88 10.72,9.46 7.24,9.46 v6.6,8.83
CS1  (via drill 0.35)
  Top 0.406: v6.82,6.45 5.5,6.45 4.45,5.4 4.45,2.86 3.18,1.59 SPI2.1
  Bottom 0.406: v6.82,6.45 6.86,6.42 8.64,8.19 18.29,8.19 U10.0
FSR_HEEL_L  (via drill 0.35)
  Top 0.406: L_FSR.5 29.69,71.4 29.47,71.18 28.68,71.18 25.57,74.28 9.54,74.28 C1.2 8.57,77.09 v8.51,77.24
  Bottom 0.406: C1.2 R10.2 6.98,70.8 6.98,58.36 U10.38
FSR_HEEL_R  (via drill 0.35)
  Top 0.152: 31.12,10.12 32.45,10.12 32.48,10.09
  Top 0.406: C2.1 8.89,8.55 6.38,11.06 6.38,23.82 6.8,24.24 6.8,32.26 U10.17 | v27.3,9.21 28.22,10.12 31.12,10.12 | FSR_R.5 33.37,9.21 32.48,10.09
  Bottom 0.406: C2.1 R9.2 8.89,2.23 v9.02,2.1 9.93,1.19 21.82,1.19 23.38,2.74 23.38,5.52 25.07,7.21 25.07,7.39 26.89,9.21 v27.3,9.21
FSR_TOE_L  (via drill 0.35)
  Top 0.406: L_FSR.4 30.69,70.69 30.13,70.13 27.98,70.13 C19.2 | R8.2 25.72,77.09 v25.65,77.24
  Bottom 0.406: R8.2 C19.2 24.45,71.12 12.38,71.12 9.83,68.57 9.83,62.55 9.83,62.15 9.83,55.62 9.34,55.12 U10.39
FSR_TOE_R  (via drill 0.35)
  Top 0.406: FSR_R.4 32.37,9.42 32.22,9.56 28.61,9.56 R7.2 C20.1 22.25,0.66 9.27,0.62 7.71,2.18 7.71,8.65 5.54,10.82 5.54,25.62 6.06,26.14 6.06,34.06 U10.16
  Bottom 0.406: C20.1 26.16,4.32 v26.16,2.1
GND  (via drill 0.35)
  Top 0.406: TRQ_L0.3 53.79,75.85 v53.85,75.91 52.22,75.91 v49.66,73.34 49.66,70.3 49.21,69.85 C22.2 | v39.75,75.25 39.7,75.19 TRQ_L1.3 | TRQ_R0.3 54.82,5.87 54.82,7.06 v56.53,7.06 | R8.1 15.88,75.57 v15.88,77.24
  Bottom 0.152: U5.2 36.2,39.37
  Bottom 0.203: 31.1,12.38 31.2,12.49 31.2,13.06 31.71,13.57 31.9,13.57 32,13.67
  Bottom 0.406: INA219.2 53.02,38.87 | 53.02,38.87 INA219.1 | 53.02,38.87 51.94,39.96 49.42,39.96 49.21,39.75 48.58,39.11 C3.1 | U3.3 40.39,75.88 v39.75,75.25 36.09,75.25 35.18,74.34 35.18,73.98 | 36.2,39.37 v38.73,39.37 40.01,38.1 U5.8 | C14.2 63.83,67.64 v62.83,67.64 | R8.1 18.41,72.39 R10.1 | INA219.6 51.12,46.01 v51.3,46.19 | C10.2 42.86,13.66 42.86,12.99 43.79,12.06 43.81,12.06 | 43.81,12.06 45.11,12.06 46.39,13.34 C7.2 | C11.2 32.07,13.73 32,13.67 | 56.53,6.99 v56.53,7.06 56.82,7.35 v56.82,10.78 | 56.53,6.99 52.3,6.99 v52.27,7.02 52.27,4.56 53.02,3.81 U2.3 | C18.2 33.34,71.44 v35.18,71.44 35.18,73.98 | 34.21,3.75 v36.2,3.75 36.89,4.45 40.11,4.45 40.51,4.85 40.51,5.91 40.07,6.35 U4.12 | U4.3 34.21,3.75 | U1.12 v49.66,73.34 | v53.85,75.91 53.87,75.88 U1.3 | 34.21,3.75 31.5,3.75 29.85,5.4 29.85,8.19 C17.2 29.77,11.05 31.1,12.38 | U2.12 57.16,6.35 56.53,6.99 | U3.12 35.81,73.34 35.18,73.98 | R9.1 17.78,3.18 v17.78,2.1 | 43.81,12.06 v43.81,10.48 | C23.1 v1.14,16.2 | v10.67,14.67 v12.45,16.45 | v40.64,8.32 41.52,9.2 41.67,9.2 41.69,9.21 v41.91,9.21 | C4.1 64.14,25.72 v62.87,24.45
  Bottom 1.27: U$11.2 57.09,30.48 C4.1 75.17,30.48 XT30UPB-F4.- 76.6,42.55 C16.-
  other vias: 39.12,67.76
  pour Top: -0.7,80.01 66.04,80.01 66.04,-1.01 -0.7,-1.01
  pour Bottom: 74.3,79.69 74.3,-0.95 90.81,-0.95 90.81,79.69
GREEN_LED_SIG  (via drill 0.35)
  Top 0.406: v14.86,40.24 14.86,39.19 G_PFET.1
  Bottom 0.406: U10.25 16.65,44.66 15.54,44.66 14.86,43.98 v14.86,40.24
L7_VIN
  Top 1.27: D1.C 62.52,39.66 SHUNT.1 | 62.55,35.64 64.06,35.64 C4.2 | D1.C 62.55,35.64 | 62.55,35.64 59.87,32.96 U$11.1 | R1.2 60.33,39.69 D1.C
  Bottom 1.27: C4.2 66.04,37.47 C16.+
N$1
  Top 0.406: RGB_LED.1 3.49,73.15 5.93,70.71 5.93,63.14 8.11,60.96 12.64,60.96 R4.2
N$2
  Top 0.406: B_PFET.3 19.62,41.59 R4.1
N$3
  Bottom 0.406: U1.13 U1.4 U1.5
N$5
  Bottom 0.406: U2.13 U2.4 U2.5
N$6
  Bottom 0.152: 63.98,18.26 R14.1
  Bottom 0.406: U2.8 60.33,15.76 60.33,17.24 61.34,18.26 63.98,18.26
N$7
  Bottom 0.406: U2.9 59.45,11.29 61.2,13.03 62,13.03 64.14,10.89 R14.2
N$8  (via drill 0.35)
  Top 0.152: TRQ_R0.2 53,6 53,9.42 52.39,10.04 C8.1
  Top 0.406: C8.1 53.53,10.8 v54.24,11.51
  Bottom 0.406: C8.1 52.39,8.26 53.02,7.62 U2.6
N$9  (via drill 0.35)
  Top 0.406: TRQ_R0.4 55.98,5.53 57.56,7.11 57.56,9.11 54.23,12.44 v54.23,12.51 53.4,13.34 C7.1
  Bottom 0.152: 53.02,10.07 53.07,10.12
  Bottom 0.254: 53.07,10.12 53.07,10.22 53.28,10.43 53.28,11.31 53.02,11.56
  Bottom 0.406: C7.1 53.02,12.7 53.02,11.56 | U2.7 53.26,8.89 52.95,9.21 52.95,9.99 53.02,10.07
N$10  (via drill 0.35)
  Top 0.406: C14.1 55.88,68.27 54.79,69.35 TRQ_L0.2
  Bottom 0.406: C14.1 59.37,69.96 | 59.37,69.96 57.26,72.07 U1.6 | 59.37,69.96 59.37,70.17 59.37,70.5 v60.05,71.19
N$11  (via drill 0.35)
  Top 0.406: TRQ_L0.4 52.79,69.85 55.93,66.72 57.3,66.72 58.29,65.72 C13.1 60.34,66.69 60.34,69.89 v60.05,70.17
  Bottom 0.406: U1.7 57.53,70.8 58.29,70.04 58.29,66.8 C13.1
N$12
  Bottom 0.406: U1.9 50.29,67.9 R16.2
N$13
  Bottom 0.406: U1.8 56.66,66.22 60.45,62.42 R16.1
N$15
  Bottom 0.152: 34.15,5.4 U4.4 | 38.73,5.08 U4.13
  Bottom 0.406: U4.5 34.15,5.4 | U4.4 38.73,5.08
N$16
  Bottom 0.406: R13.1 36.51,12.53 U4.8
N$17
  Top 0.406: S_P_FET.3 R3.2
N$18
  Bottom 0.406: R3.1 3.49,58.37 SYNC_LED.2
N$23
  Top 0.406: C9.1 58.1,50.9 57.14,49.93 57.14,46.03 R2.1
  Bottom 0.406: INA219.8 53.79,44.45 R2.1
N$24
  Top 0.406: RGB_LED.4 3.49,62.81 4.73,61.57 4.8,61.5 4.81,61.49 4.81,57.58 7.07,55.32 10.47,55.32 R6.2
N$25
  Top 0.406: RGB_LED.2 3.49,70.61 5.37,68.73 5.37,57.81 7.31,55.88 13.91,55.88 R5.2
N$26
  Bottom 0.406: C9.2 R1.1 55.89,45.42 53.24,45.42 53.02,45.2 53.02,44.95 INA219.7
N$27
  Bottom 0.406: R13.2 38.88,22.09 U4.9
N$28  (via drill 0.35)
  Top 0.152: TRQ_R1.2 39.43,7.94
  Top 0.406: C17.1 32.91,11.05 34.46,9.5 37.87,9.5 39.43,7.94 | TRQ_R1.2 39.44,4.69 40.01,4.13 41.6,4.13 42.56,5.1 v42.56,7.29
  Bottom 0.406: C17.1 32.1,11.02 32.1,8.22 32.7,7.62 U4.6
N$29  (via drill 0.35)
  Top 0.406: TRQ_R1.4 41.44,6.67 41.44,7.47 | 41.44,7.47 41.44,8.63 40.31,9.76 40.31,9.77 40.01,10.07 35.2,10.07 32.58,12.7 C11.1 | v42.55,8.58 41.44,7.47
  Bottom 0.152: U4.7 32.85,8.89 32.53,9.21 32.53,10.33 32.91,10.7 32.91,11.86 C11.1
N$30
  Top 0.406: G_PFET.3 15.88,43.63 R5.1
N$31
  Top 0.406: R_PFET.3 R6.1
N$32
  Bottom 0.406: U3.5 U3.4 42.05,74.59 37.83,74.59 37.8,74.61 U3.13
N$33  (via drill 0.35)
  Top 0.406: TRQ_L1.2 40.7,72.02 C22.1
  Bottom 0.406: 43.94,71.31 44.13,71.12 C22.1 | 43.94,71.31 43.18,72.07 U3.6 | 43.94,71.31 v45.34,72.71
N$34  (via drill 0.35)
  Top 0.406: TRQ_L1.4 38.73,73.75 38.73,70.17 41.53,67.37 41.74,67.37 43.07,66.04 C21.1 44.13,67.22 45.1,68.18 45.1,71.45 v45.36,71.71
  Bottom 0.203: 43.57,70.17 43.57,69.24 42.93,68.6 42.93,68.27
  Bottom 0.406: C21.1 42.93,67.25 42.93,68.27 | 43.57,70.17 42.94,70.8 U3.7
N$35
  Bottom 0.406: U3.9 37.33,68.27 34.15,65.09 R15.2
N$36
  Bottom 0.406: U3.8 42.05,65.27 R15.1
N$44  (via drill 0.35)
  Top 0.152: CAN_L0.1 61.75,73.75
  Top 0.406: v47.94,68.9 47.74,69.1 CAN_L1.1 | v58.37,72.58 61.75,72.58 61.75,73.75 | CAN_R1.1 46.49,7.94 | 46.49,7.94 46.49,10.01 | v46.36,14.29 46.36,13.75 46.34,13.74 46.34,10.4 46.49,10.25 46.49,10.01 | CAN_L0.1 61.78,72.3 65.42,68.66 65.42,67.6 66.67,66.35 66.67,14.84 60.8,8.98 60.8,5.89 CAN_R0.1 60.3,5.54 60.24,5.6 57.53,5.6 56.06,4.13 51.44,4.13 48.28,7.28 48.28,8.21 46.49,10.01 | 46.49,7.94 44.32,7.94 v43.81,8.45
  Bottom 0.254: 50.06,72.65 58.31,72.65 v58.37,72.58
  Bottom 0.406: 50.06,72.65 47.94,70.53 v47.94,68.9 47.94,63.18 42.23,57.47 42.23,40.24 41.98,39.99 41.5,39.99 U5.7 41.5,38.76 41.98,38.76 42.23,38.51 42.23,37.7 41.98,37.45 39.03,37.45 R11.2 | v46.36,14.29 46.36,16.83 R12.2
N$45  (via drill 0.35)
  Top 0.406: v46.99,68.9 46.99,73.53 CAN_L1.2 | CAN_R0.2 62.59,6.67 v64.14,6.67 65.41,7.94 65.41,11.75 68.16,14.5 v68.16,62.76 | v58.93,73.28 60.28,73.28 CAN_L0.2 | v47.62,7.94 47.49,7.8 CAN_R1.2 47.65,5.54 47.71,5.6 48.43,5.6 51.14,2.88 51.92,2.88 51.95,2.86 55.72,2.86 v56.95,4.09
  Bottom 0.305: 46.99,71.44 46.99,69.52 | 50.7,75.25 57.82,75.25
  Bottom 0.406: 39.55,41.51 39.55,42.32 40.89,43.66 40.89,58.99 46.99,65.09 v46.99,68.9 | v68.16,62.76 65.42,62.76 61.58,66.59 61.58,70.63 v58.93,73.28 58.93,74.22 57.89,75.25 57.82,75.25 | R12.1 53.99,14.3 51.99,14.3 51.42,13.74 51.42,11.74 v47.62,7.94 46.99,7.3 v43.81,7.3 | 39.55,41.51 39.8,41.26 40.27,41.26 U5.6 | R11.1 36.29,44.77 39.55,41.51 | 46.99,69.52 v46.99,68.9 | v46.99,68.9 46.99,71.44 46.99,71.61 50.63,75.25 50.7,75.25 | v56.95,4.09 57.6,4.09 57.95,4.45 61.91,4.45 62.87,5.4 v64.14,6.67
NANO_RX
  Top 0.406: USB.B2 25.4,53.02 22.23,53.02 21.59,53.66 21.59,56.84 13.97,64.45 U10.35
NANO_TX
  Top 0.406: USB.B1 25.4,55.57 25.4,62.8 25.02,63.18 22.23,63.18 18.41,66.99 U10.34
RED_LED_SIG
  Top 0.406: U10.14 10.98,39.12 R_PFET.1
RESET
  Top 0.406: USB.A13 30.89,46.68 29.54,48.03 26.74,48.03 24.6,50.17 21.61,50.17 13.98,57.79 13.19,57.79 12.24,56.84 U10.ON/OFF
  Bottom 0.406: RESET.1 2.1,44.77 2.1,45.34 2.1,47.75 7.68,53.34 8.91,53.34 10.59,55.03 10.59,56.38 U10.ON/OFF
SCK1  (via drill 0.35)
  Top 0.406: v13.34,34.61 9.53,30.8 9.53,26.54 10.29,25.77 16.28,25.77 19.13,22.93 19.13,19.32 v15.75,15.94 | v5.78,9.48 5.68,9.38 3.96,9.38 3.78,9.21 SPI2.4
  Bottom 0.406: U10.27 20.32,56.84 15.88,52.39 15.88,46.83 13.64,44.6 13.64,39.73 13.67,39.71 13.67,34.94 v13.34,34.61 | v15.75,15.94 9.83,10.02 7.01,10.02 6.47,9.48 v5.78,9.48
SCL0  (via drill 0.35)
  Top 0.406: NANO_I2C.3 71.48,10.75 v69.22,13.02 | USB.A9 47.62,33.34 47.62,26.99 48.39,26.23 54.74,26.23 v65.41,15.56
  Bottom 0.406: USB.A9 48.26,36.52 49.85,38.1 INA219.4 | v65.41,15.56 66.68,15.56 v69.22,13.02
SCL_TEENSY
  Bottom 0.406: TEENSY_I2C.2 7.87,29.53 U10.19
SDA0  (via drill 0.35)
  Top 0.406: NANO_I2C.1 69.48,10.21 v67.94,11.75 | USB.A8 47.07,31.36 47.07,26.76 48.16,25.67 52.76,25.67 60.31,18.11 62,18.11 62.56,17.55 62.56,17.13 v65.3,14.4
  Bottom 0.406: INA219.3 51.12,38.1 46.99,33.98 USB.A8 | v65.3,14.4 v67.94,11.75
SDA_TEENSY
  Bottom 0.406: TEENSY_I2C.1 7.87,32.07 U10.18
STOP
  Bottom 0.406: STOP.1 3.18,17.59 9.65,17.59 12.07,20.01 12.07,25.72 22.86,36.52 U10.9
SYNC_DEFAULT  (via drill 0.35)
  Top 0.406: v10.8,26.99 23.11,26.99 U10.5
  Bottom 0.406: v10.8,26.99 9.23,26.99 8.91,27.31 5.4,27.31 SYNC_DEFAULT.1
SYNC_SIG
  Top 0.406: U10.15 5.78,39.05 4.99,38.27 3.4,38.27 S_P_FET.1
TRQ_AMP_L  (via drill 0.35)
  Top 0.406: v43.81,63.82 C12.1 | v18.03,49.72 17.53,49.22 U10.41
  Bottom 0.406: U1.11 U1.10 53.34,70.8 53.98,70.17 53.98,65.41 C12.1 | 38.73,63.82 33.66,63.82 25.09,55.25 23.05,55.25 18.03,50.23 v18.03,49.72 | 38.73,63.82 v43.81,63.82 | 38.73,63.82 38.73,66.36 v39.12,66.74
TRQ_AMP_L1  (via drill 0.35)
  Top 0.406: C18.1 38.61,68.27 v39.12,68.77 | v18.03,51.76 U10.40
  Bottom 0.406: U3.11 U3.10 36.51,70.8 35.24,69.53 C18.1 33.03,66.05 31.67,66.05 31.1,65.49 31.1,64.12 30.09,63.12 29.88,62.86 29.62,62.64 24.71,57.73 24.71,56.44 24.15,55.88 22.89,55.88 20.02,53.01 19.29,53.01 v18.03,51.76
TRQ_AMP_R  (via drill 0.35)
  Top 0.152: 28.24,15.23 28.34,15.13 29.85,15.13 | 45.35,15.01 45.23,15.13 43.18,15.13
  Top 0.406: 43.18,15.13 42.58,15.13 | 42.58,15.13 42.24,15.46 42.24,15.64 41.67,16.21 36,16.21 34.93,15.13 29.85,15.13 | C6.1 58.66,15.01 45.35,15.01 | 28.24,15.23 12.4,15.23 9.85,17.78 8.11,17.78 7.49,18.4 7.49,22.8 U10.21 | 42.58,15.13 42.58,11.72 v42.93,11.37
  Bottom 0.406: U2.11 U2.10 61.28,8.89 61.59,9.21 C6.1
TRQ_AMP_R1  (via drill 0.35)
  Top 0.406: U10.20 8.51,25.17 6.93,23.59 6.93,18.17 7.88,17.22 9.39,17.22 14.1,12.51 26.89,12.51 27.65,11.75 29.75,11.75 31.67,13.67 32.47,13.67 34.38,11.75 39.69,11.75 C10.1 43.12,10.16 v43.81,9.46
  Bottom 0.406: U4.11 U4.10 40.01,8.89 C10.1
VCC1  (via drill 0.6)
  Top 0.406: SHUNT.2 52.68,44.8 52.7,44.77
  Top 1.27: 52.7,44.77 55.56,47.63 R2.2 | v71.75,46.04 78.11,46.04 XT30UPB-F4.+
  Bottom 1.27: R2.2 56.13,54.61 57.52,56.01 58.68,56.01 59.5,55.19 59.5,54.15 67.74,45.91 71.63,45.91 v71.75,46.04
  pour Top: 74.3,79.69 74.3,-0.31 90.17,-0.31 90.17,79.69
VIN
  Top 1.27: C15.1 46.99,49.85 46.99,45.72 C3.2 46.99,42.55 46.99,38.67 52.63,33.02 C5.1 50.17,29.85 U$6.1
  Bottom 1.27: C3.2 48.76,44.32 INA219.5 | C5.1 55.49,30.88 55.49,29.78 57.02,28.25 U$11.3
VIN_PF  (via drill 0.35)
  Top 0.406: v42.93,25.09 43.01,25 45.23,25 45.43,24.8
  Top 0.813: U$6.2 46.96,23.27 45.43,24.8 | U10.VIN v14.06,11.12
  Bottom 0.406: 22.91,19.96 23.21,20.26 24.51,20.26 | 28.33,22.46 30.23,22.46 | v1.14,11.12 C23.2
  Bottom 0.813: USB.A15 44.45,51.18 43.06,49.79 43.06,35.12 35.12,27.18 | 24.51,20.26 26.13,20.26 28.33,22.46 | 30.23,22.46 30.4,22.46 35.12,27.18 | v42.93,25.09 40.83,27.18 35.12,27.18 | v14.06,11.12 22.91,19.96 | U10.VIN C23.2 4.92,10.52 4.92,3.89 6.41,2.39 FAN.1

### Text on the board
tPlace: AK_Board V0.41 / Teensy 4.1
tDocu: Updates to make: | 1. Test with multiple motors running to make sure the sensors still work. | 2. Pull up on reset | 3. Remove SPI, replace with Serial and I2C between boards | 5. Heatsink/vias on power componenets.
_tsilk: FSR_HEEL_L | GND | FSR_TOE_L | GND | L0_ENABLE_STOP | L1_ENABLE_STOP | L1_TRQ+ | L1_TRQ- | L0_TRQ+ | L0_TRQ- | TRQ_AMP_L1 | GND | GND | TRQ_AMP_L | - | + | P_CHANNEL | P_CHANNEL | P_CHANNEL | P_CHANNEL | CAN_TX | GND | CAN_RX | R0_ENABLE_STOP | R1_ENABLE_STOP | GND | 3.3V | R0_TRQ- | 5v | TRQ_AMP_R | R0_TRQ+ | GND | SCK1 | R1_TRQ- | TRQ_AMP_R1 | CAN_H | R1_TRQ+ | CAN_L | COPI1 | CIPO1 | FSR_HEEL_R | GND | COPI | CIPO | CS | SCK | FSR_TOE_R | CS1 | NANO
_bsilk: N_CHANNEL | N_CHANNEL | P_CHANNEL | P_CHANNEL | P_CHANNEL | N_CHANNEL | N_CHANNEL | P_CHANNEL